# Altium schematic sheet MIXR UI - Connectors.SchDoc: Title
size B; Organization: Midnight Sun Solar Rayce Car Team; Address1: University of Waterloo; Address2: 200 University Ave W; Address3: Waterloo, ON, Canada; Address4: N2L 3E9; Website: www.uwmidsun.com; ProjectName: ProjectName
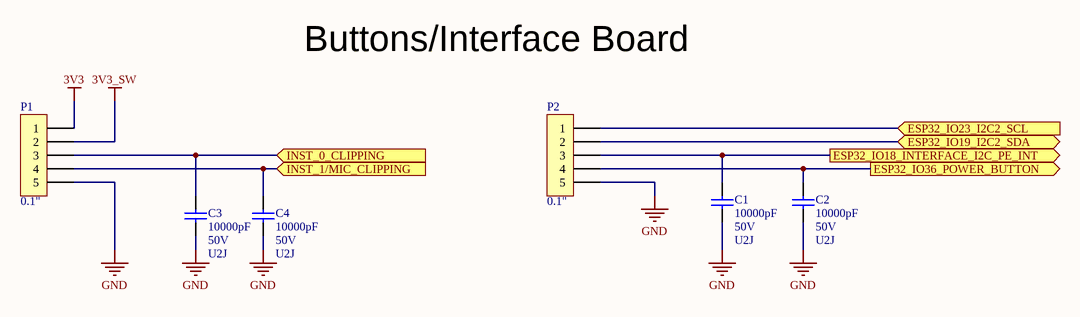
[diagram p0: MIXR UI - Connectors.SchDoc]

## Parts
C1  Capacitance: 10000pF  Voltage: 50V  Temperature Coefficient: U2J  [CAP, 0603]  (hidden comment: CAP CER 10nF 50V 5% X7R 0603)
C2  Capacitance: 10000pF  Voltage: 50V  Temperature Coefficient: U2J  [CAP, 0603]  (hidden comment: CAP CER 10nF 50V 5% X7R 0603)
C3  Capacitance: 10000pF  Voltage: 50V  Temperature Coefficient: U2J  [CAP, 0603]  (hidden comment: CAP CER 10nF 50V 5% X7R 0603)
C4  Capacitance: 10000pF  Voltage: 50V  Temperature Coefficient: U2J  [CAP, 0603]  (hidden comment: CAP CER 10nF 50V 5% X7R 0603)
P1  0.1"  [CONN, 5POS 0.3" 0.100" FEMALE HEADER]
P2  0.1"  [CONN, 5POS 0.3" 0.100" FEMALE HEADER]

## Ports
ESP32_IO18_INTERFACE_I2C_PE_INT (out), ESP32_IO19_I2C2_SDA (bidir), ESP32_IO23_I2C2_SCL (in), ESP32_IO36_POWER_BUTTON (out), INST_0_CLIPPING (in), INST_1/MIC_CLIPPING (in)

## Nets
3V3: P1.1
3V3_SW: P1.2
GND: C1.2 C2.2 C3.2 C4.2 P1.5 P2.5
ESP32_IO18_INTERFACE_I2C_PE_INT: C1.1 P2.3 ; port ESP32_IO18_INTERFACE_I2C_PE_INT
ESP32_IO19_I2C2_SDA: P2.2 ; port ESP32_IO19_I2C2_SDA
ESP32_IO23_I2C2_SCL: P2.1 ; port ESP32_IO23_I2C2_SCL
ESP32_IO36_POWER_BUTTON: C2.1 P2.4 ; port ESP32_IO36_POWER_BUTTON
INST_0_CLIPPING: C3.1 P1.3 ; port INST_0_CLIPPING
INST_1/MIC_CLIPPING: C4.1 P1.4 ; port INST_1/MIC_CLIPPING

## Notes on the sheet
- Buttons/Interface Board
- PROJECT
- DOCUMENT
- DRAWN BY
- LAST MODIFIED
- PART NUMBER
- REVISION
- SHEET
- VARIANT
- OF

## Library data of the parts
C1-C4 = CAP CER 10nF 50V 5% X7R 0603: 10000pF ±5% 50V Ceramic Capacitor U2J 0603 (1608 Metric); Manufacturer 1: KEMET; Manufacturer Part Number 1: C0603C103J5JAC7867; Supplier 1: Digi-Key; Supplier Part Number 1: 399-13384-1-ND; Packaging: Cut Tape (CT); Part Status: Active; Operating Temperature: -55°C ~ 125°C; Ratings: -; Failure Rate: -; Mounting Type: Surface Mount, MLCC; Package / Case: 0603 (1608 Metric); Size / Dimension: 0.063" L x 0.032" W (1.60mm x 0.80mm); Height - Seated (Max): -; Thickness (Max): 0.034" (0.87mm); Lead Spacing: -; Lead Style: -; ComponentLink1URL: http://www.kemet.com/docfinder?Partnumber=C0603C103J5JAC7867; ComponentLink1Description: http://www.kemet.com/docfinder?Partnumber=C0603C103J5JAC7867; Tolerance: ±5%
P1 P2 = CONN 5POS 0.1" 0.3" FEMALE HEADER: 5 Position Receptacle Connector Through Hole; Manufacturer: Samtec; Manufacturer Part Number: SSW-105-01-T-S; Connector Type: Receptacle,Socket; Number of Positions: 5; Max Current Rating: 6.9A; Max Voltage Rating (AC): 550V; Contact Resistance: 10mR; Mating Cycles: 100; Pitch: 2.54mm; Supplier 1: Digi-Key; RoHS: Yes; Category: Headers and Wire Housings; Stock 1: 1361; Pricing 1: 1=0.55000, 10=0.51100, 25=0.46000, 50=0.40900, 100=0.39190, 250=0.35784, 500=0.34080 (USD); Mount: Through Hole; Contact Plating: Tin,Matte; Color: Black; Contact Material: Bronze; Housing Color: Black; Housing Material: Polymer; Min Operating Temperature: -55°C; Max Operating Temperature: 105°C; Number of Rows: 1; Packaging: Bulk; Termination: Solder; Gender: Receptacle; Number of Contacts: 5; Orientation: Vertical; Length: 13.21mm; Depth: 2.41mm; Width: 2.41mm; Radiation Hardening: No; Lead Free: Lead Free; REACH SVHC: No SVHC; ComponentLink1URL: https://datasheet.ciiva.com/750/ssw-1xx-xx-xxx-x-xx-xxx-xx-mkt-750073.pdf?src-supplier=Digi-Key; ComponentLink1Description: https://datasheet.ciiva.com/750/ssw-1xx-xx-xxx-x-xx-xxx-xx-mkt-750073.pdf?src-supplier=Digi-Key; Supplier Part Number 1: SAM1213-05-ND; System: Connector